# Altium schematic sheet Camera_Interface.SCHDOC: Evaluation Board 3.2
size A3; Organization: Toradex AG; Address1: Altsagenstrasse 5; Address2: Horw; Address3: 6048; Address4: Switzerland; DocumentNumber: 13; Revision: V3.2; SheetNumber: 13; SheetTotal: 23; PageSetup: Record=PageOptions|CenterHorizontal=True|CenterVertical=True|PrintScale=0.73|XCorrection=1.00|YCorrection=1.00|PrintKind=0|BorderSize=5000000|LeftOffset=0|BottomOffset=0|Orientation=2|PaperLength=1000|PaperWidth=1000|Scale=100|PaperSource=7|PrintQuality=-4|MediaType=1|DitherType=10|PaperKind=A4|PrintScaleMode=1
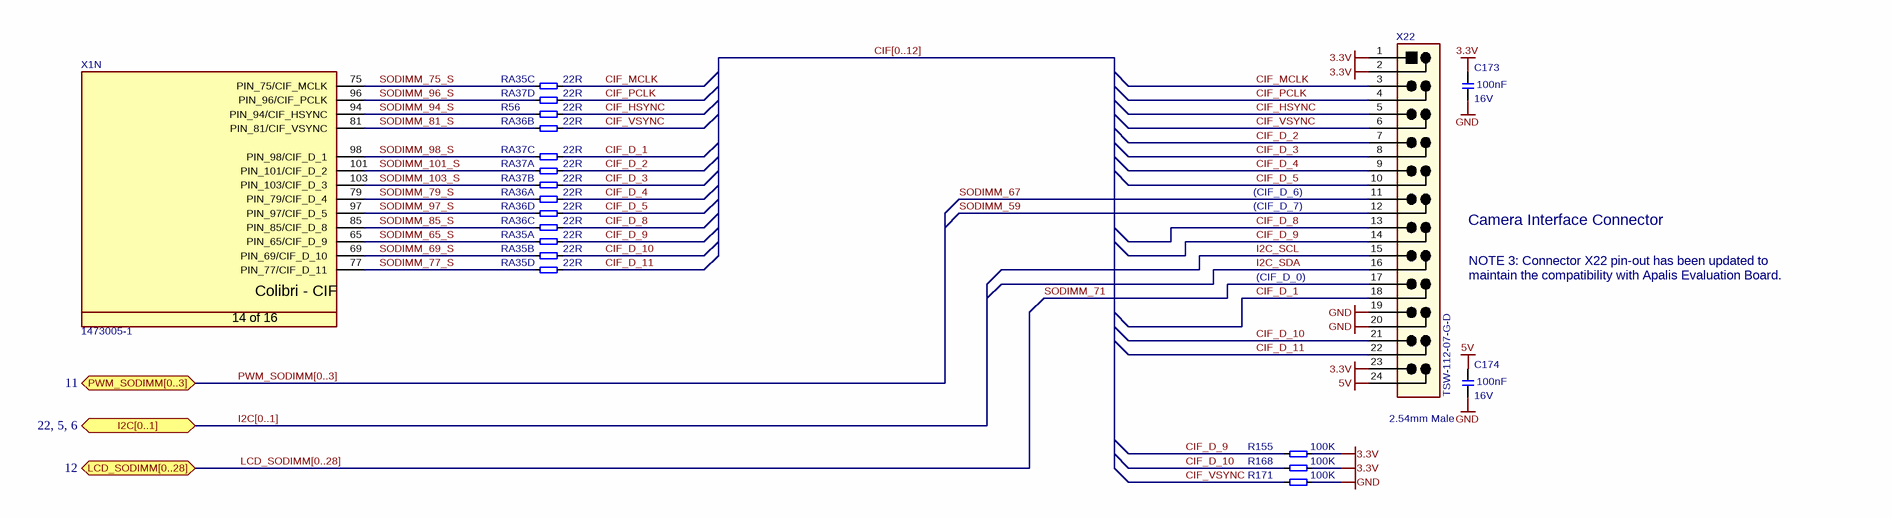
[diagram p0: Camera_Interface.SCHDOC]

## Parts
C173  Rating: 16V  [T_CAPC0603X33N]  (hidden comment: 100nF)
C174  Rating: 16V  [T_CAPC0603X33N]  (hidden comment: 100nF)
R56  22R  [RESC1005X40N]
R155  100K  [T_RESC0603X30N]
R168  100K  [T_RESC0603X30N]
R171  100K  [T_RESC0603X30N]
RA35  22R  [T_Resistor_Array_X4]  (parts A,B,C,D of 4)
RA36  22R  [T_Resistor_Array_X4]  (parts A,B,C,D of 4)
RA37  22R  [T_Resistor_Array_X4]  (parts A,B,C,D of 4)
X1  Manufacturer Part No.: 1473005-1  [T_Tyco_1473005-1]  (hidden comment: CON-Tyco-1473005-1-200-0.6mm)  (part N of 16)
X22  TSW-112-07-G-D  [T_Samtec_TSW-112-07-G-D]

## Ports
I2C[0..1] (bidir, see 22, 5, 6), LCD_SODIMM[0..28] (bidir, see 12), PWM_SODIMM[0..3] (bidir, see 11)

## Nets
3.3V: C173.2 R155.2 R168.2 X22.1 X22.2 X22.23
5V: C174.2 X22.24
GND: C173.1 C174.1 R171.2 X22.19 X22.20
CIF_D_1: RA37.7 X22.18
CIF_D_2: RA37.5 X22.7
CIF_D_3: RA37.6 X22.8
CIF_D_4: RA36.5 X22.9
CIF_D_5: RA36.8 X22.10
CIF_D_8: RA36.7 X22.13
CIF_D_9: R155.1 RA35.5 X22.14
CIF_D_10: R168.1 RA35.6 X22.21
CIF_D_11: RA35.8 X22.22
CIF_HSYNC: R56.2 X22.5
CIF_MCLK: RA35.7 X22.3
CIF_PCLK: RA37.8 X22.4
CIF_VSYNC: R171.1 RA36.6 X22.6
I2C_SCL: X22.15
I2C_SDA: X22.16
SODIMM_59: X22.12
SODIMM_65_S: RA35.1 X1.65(PIN_65/CIF_D_9)
SODIMM_67: X22.11
SODIMM_69_S: RA35.2 X1.69(PIN_69/CIF_D_10)
SODIMM_71: X22.17
SODIMM_75_S: RA35.3 X1.75(PIN_75/CIF_MCLK)
SODIMM_77_S: RA35.4 X1.77(PIN_77/CIF_D_11)
SODIMM_79_S: RA36.1 X1.79(PIN_79/CIF_D_4)
SODIMM_81_S: RA36.2 X1.81(PIN_81/CIF_VSYNC)
SODIMM_85_S: RA36.3 X1.85(PIN_85/CIF_D_8)
SODIMM_94_S: R56.1 X1.94(PIN_94/CIF_HSYNC)
SODIMM_96_S: RA37.4 X1.96(PIN_96/CIF_PCLK)
SODIMM_97_S: RA36.4 X1.97(PIN_97/CIF_D_5)
SODIMM_98_S: RA37.3 X1.98(PIN_98/CIF_D_1)
SODIMM_101_S: RA37.1 X1.101(PIN_101/CIF_D_2)
SODIMM_103_S: RA37.2 X1.103(PIN_103/CIF_D_3)

## Buses and harness runs
bus CIF[0..12]
bus I2C[0..1] = port I2C[0..1]
bus LCD_SODIMM[0..28] = port LCD_SODIMM[0..28]
bus PWM_SODIMM[0..3] = port PWM_SODIMM[0..3]

## Notes on the sheet
- (CIF_D_7)
- (CIF_D_6)
- Camera Interface Connector
- (CIF_D_0)
- NOTE 3: Connector X22 pin-out has been updated to
- maintain the compatibility with Apalis Evaluation Board.
- 2.54mm Male
- Title
- Size:
- Date:
- A3
- Number:
- Time:
- Revision:
- Sheet
- of
- File:
- (in symbol CON-Tyco-1473005-1-200-0.6mm, part N) Colibri - CIF; 14 of 16

## Library data of the parts
C173 C174 = C-X7R-100nF-16V-10%-0603: Capacitor Ceramic X7R 100nF 16V 10% 0603; Tolerance: 10%; Type: X7R; Value: 100nF
R56 = R-22R-63mW-5%-0402: Resistor 22 ohm 63mW 5% 0402; Rating: 63mW; Tolerance: 5%; Value: 22R
R155 R168 R171 = R-100KR-63mW-5%-0603: Resistor 100 Kohm 63mW 5% 0603; Value: 100KR; Rating: 63mW; Tolerance: 5%
RA35-RA37 = RA-22R-63mW-5%-1206-div: Resistor Array 22 R 63mW 5% 1206; Tolerance: 5%; Power Dissipation: 63mW; Value: 22R
X1 = CON-Tyco-1473005-1-200-0.6mm: SODIMM Connector; Manufacturer Name: Tyco; No. of ways: 200
X22 = CON-Samtec-TSW-112-07-G-D: Header male, 2x12 Pins, 2.54 mm pitch; Manufacturer Name: Samtec; Pitch: 2.54 mm; No. of ways: 2x12; Manufacturer Part No.: TSW-112-07-G-D